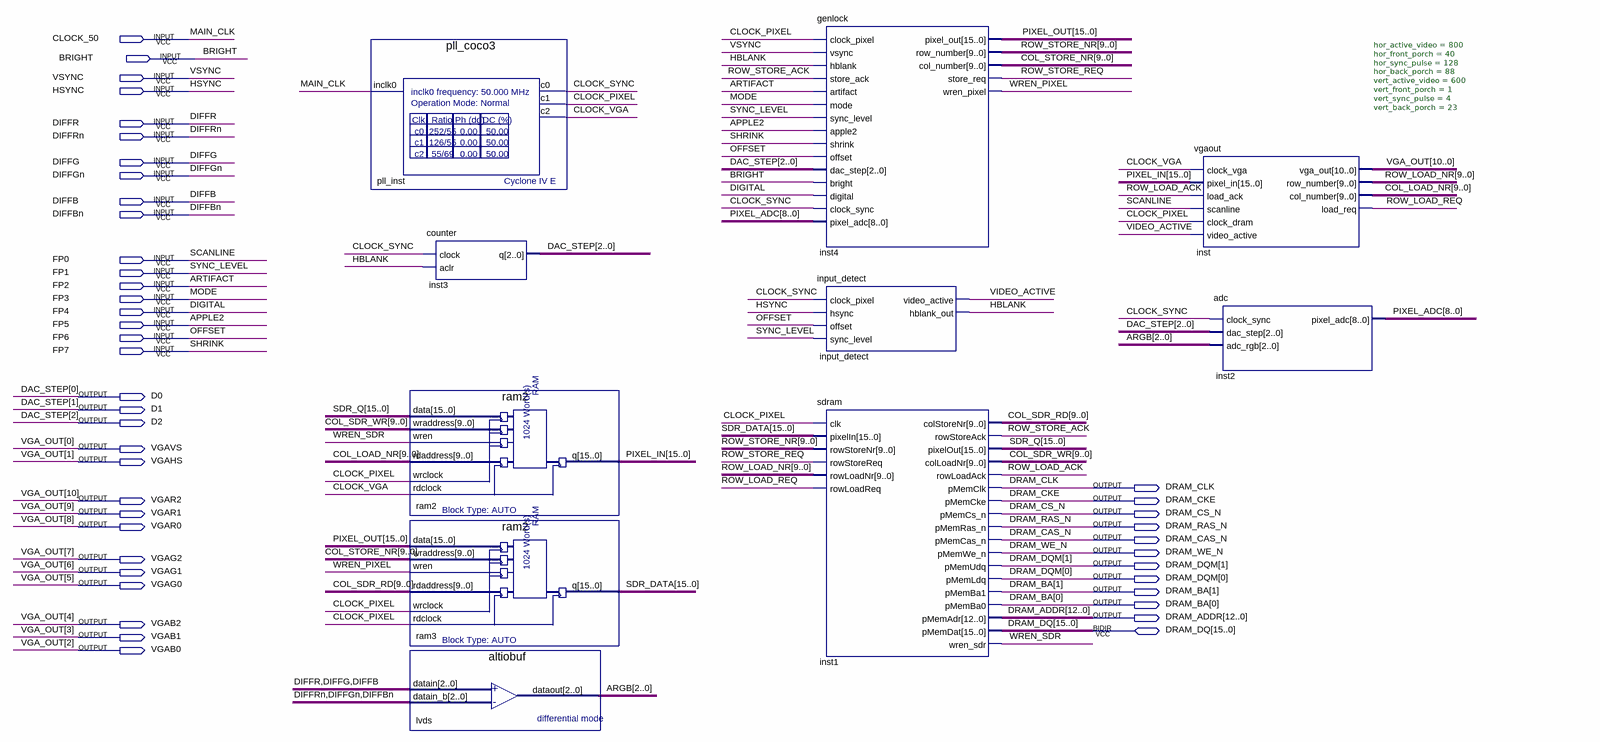
[diagram p0: schematic sheet]
// Quartus schematic coco3.bdf as structural Verilog: 10 symbols, 44 pins
module coco3 (
  input  CLOCK_50,
  input  BRIGHT,
  input  VSYNC,
  input  HSYNC,
  input  DIFFR,
  input  DIFFRn,
  input  DIFFG,
  input  DIFFGn,
  input  DIFFB,
  input  DIFFBn,
  input  FP0,
  input  FP1,
  input  FP2,
  input  FP3,
  input  FP4,
  input  FP5,
  input  FP6,
  input  FP7,
  inout  [15:0] DRAM_DQ,
  output D0,
  output D1,
  output D2,
  output VGAVS,
  output VGAHS,
  output DRAM_CLK,
  output VGAR2,
  output DRAM_CKE,
  output VGAR1,
  output DRAM_CS_N,
  output VGAR0,
  output DRAM_RAS_N,
  output DRAM_CAS_N,
  output DRAM_WE_N,
  output VGAG2,
  output [1:0] DRAM_DQM,
  output VGAG1,
  output VGAG0,
  output [1:0] DRAM_BA,
  output [12:0] DRAM_ADDR,
  output VGAB2,
  output VGAB1,
  output VGAB0
);

  wire CLOCK_PIXEL, CLOCK_SYNC, CLOCK_VGA, HBLANK, ROW_LOAD_ACK, ROW_LOAD_REQ, ROW_STORE_ACK, ROW_STORE_REQ,
       VIDEO_ACTIVE, WREN_PIXEL, WREN_SDR;
  wire [2:0] ARGB;
  wire [8:0] PIXEL_ADC;
  wire [9:0] COL_LOAD_NR, COL_SDR_RD, COL_SDR_WR, COL_STORE_NR, ROW_LOAD_NR, ROW_STORE_NR;
  wire [15:0] PIXEL_IN, PIXEL_OUT, SDR_DATA, SDR_Q;

  pll_coco3 pll_inst (.inclk0(CLOCK_50), .c0(CLOCK_SYNC), .c1(CLOCK_PIXEL), .c2(CLOCK_VGA));
  counter inst3 (.clock(CLOCK_SYNC), .aclr(HBLANK), .q({D2, D1, D0}));
  ram2 ram2 (
    .data(SDR_Q), .wraddress(COL_SDR_WR), .wren(WREN_SDR), .rdaddress(COL_LOAD_NR), .wrclock(CLOCK_PIXEL),
    .rdclock(CLOCK_VGA), .q(PIXEL_IN));
  ram2 ram3 (
    .data(PIXEL_OUT), .wraddress(COL_STORE_NR), .wren(WREN_PIXEL), .rdaddress(COL_SDR_RD),
    .wrclock(CLOCK_PIXEL), .rdclock(CLOCK_PIXEL), .q(SDR_DATA));
  altiobuf lvds (.datain({DIFFR, DIFFG, DIFFB}), .datain_b({DIFFRn, DIFFGn, DIFFBn}), .dataout(ARGB));
  genlock inst4 (
    .clock_pixel(CLOCK_PIXEL), .vsync(VSYNC), .hblank(HBLANK), .store_ack(ROW_STORE_ACK), .artifact(FP2),
    .mode(FP3), .sync_level(FP1), .apple2(FP5), .shrink(FP7), .offset(FP6), .dac_step({D2, D1, D0}),
    .bright(BRIGHT), .digital(FP4), .clock_sync(CLOCK_SYNC), .pixel_adc(PIXEL_ADC), .pixel_out(PIXEL_OUT),
    .row_number(ROW_STORE_NR), .col_number(COL_STORE_NR), .store_req(ROW_STORE_REQ), .wren_pixel(WREN_PIXEL));
  input_detect input_detect (
    .clock_pixel(CLOCK_SYNC), .hsync(HSYNC), .offset(FP6), .sync_level(FP1), .video_active(VIDEO_ACTIVE),
    .hblank_out(HBLANK));
  sdram inst1 (
    .clk(CLOCK_PIXEL), .pixelIn(SDR_DATA), .rowStoreNr(ROW_STORE_NR), .rowStoreReq(ROW_STORE_REQ),
    .rowLoadNr(ROW_LOAD_NR), .rowLoadReq(ROW_LOAD_REQ), .colStoreNr(COL_SDR_RD), .rowStoreAck(ROW_STORE_ACK),
    .pixelOut(SDR_Q), .colLoadNr(COL_SDR_WR), .rowLoadAck(ROW_LOAD_ACK), .pMemClk(DRAM_CLK),
    .pMemCke(DRAM_CKE), .pMemCs_n(DRAM_CS_N), .pMemRas_n(DRAM_RAS_N), .pMemCas_n(DRAM_CAS_N),
    .pMemWe_n(DRAM_WE_N), .pMemUdq(DRAM_DQM[1]), .pMemLdq(DRAM_DQM[0]), .pMemBa1(DRAM_BA[1]),
    .pMemBa0(DRAM_BA[0]), .pMemAdr(DRAM_ADDR), .wren_sdr(WREN_SDR), .pMemDat(DRAM_DQ));
  vgaout #(.hor_active_video(800), .hor_front_porch(40), .hor_sync_pulse(128), .hor_back_porch(88), .vert_active_video(600), .vert_front_porch(1), .vert_sync_pulse(4), .vert_back_porch(23)) inst (
    .clock_vga(CLOCK_VGA), .pixel_in(PIXEL_IN), .load_ack(ROW_LOAD_ACK), .scanline(FP0),
    .clock_dram(CLOCK_PIXEL), .video_active(VIDEO_ACTIVE),
    .vga_out({VGAR2, VGAR1, VGAR0, VGAG2, VGAG1, VGAG0, VGAB2, VGAB1, VGAB0, VGAHS, VGAVS}),
    .row_number(ROW_LOAD_NR), .col_number(COL_LOAD_NR), .load_req(ROW_LOAD_REQ));
  adc inst2 (.clock_sync(CLOCK_SYNC), .dac_step({D2, D1, D0}), .adc_rgb(ARGB), .pixel_adc(PIXEL_ADC));

  // Other names for the same wires on the sheet: APPLE2 = FP5; ARTIFACT = FP2; DAC_STEP[2:0] = {D2, D1, D0};
  //   DIGITAL = FP4; MAIN_CLK = CLOCK_50; MODE = FP3; OFFSET = FP6; SCANLINE = FP0; SHRINK = FP7; SYNC_LEVEL = FP1;
  //   VGA_OUT[10:0] = {VGAR2, VGAR1, VGAR0, VGAG2, VGAG1, VGAG0, VGAB2, VGAB1, VGAB0, VGAHS, VGAVS}
endmodule
